# EAGLE design panandtilt (EAGLE 6.6.0)
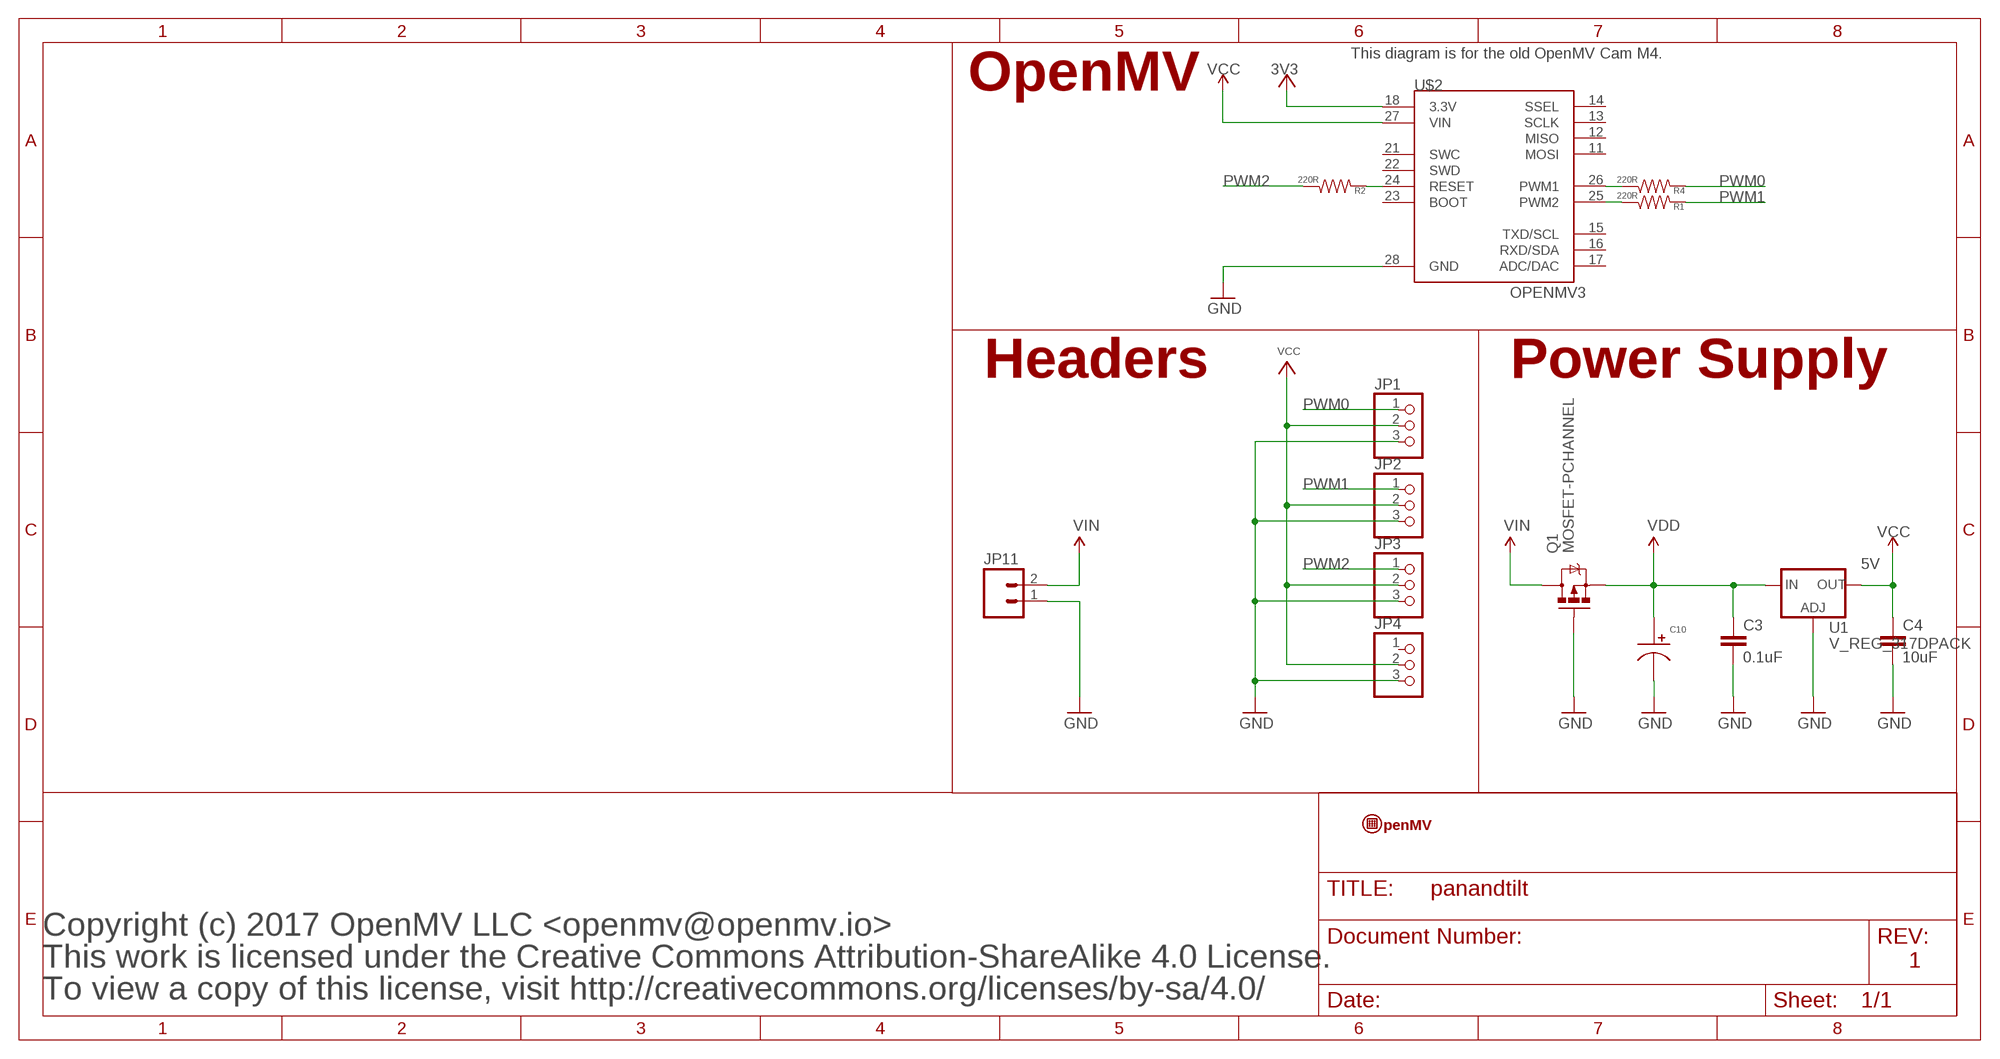
[diagram p0: schematic, sheet 1]

## Parts
C3  0.1uF  CAP0603-CAP  [0603-CAP]
C4  10uF  CAP0805  [0805]
C10  CAPACITOR_P_10MM  [CP10MM]
JP1  PINHD-1X3  [1X03]
JP2  PINHD-1X3  [1X03]
JP3  PINHD-1X3  [1X03]
JP4  PINHD-1X3  [1X03]
JP11  M023.5MM  [SCREWTERMINAL-3.5MM-2]
Q1  MOSFET-PCHANNEL  [SOT23-3]
R1  220R  RESISTOR0603-RES  [0603-RES]
R2  220R  RESISTOR0603-RES  [0603-RES]
R4  220R  RESISTOR0603-RES  [0603-RES]
U1  V_REG_317DPACK  [V-REG_DPACK]
U$2  OPENMV3  [OPENMV3]
U$9  OPENMV-LOGO  [OPENMV-LOGO]

## Nets
3V3: U$2.18(3.3V)
GND: C3.2 C4.2 C10.P$2 JP1.3 JP2.3 JP3.3 JP4.3 JP11.1 Q1.1(G) U1.1(ADJ) U$2.28(GND)
N$1: R4.1 U$2.26(PWM1)
N$2: R1.1 U$2.25(PWM2)
N$5: R2.2 U$2.24(RESET)
PWM0: JP1.1 R4.2
PWM1: JP2.1 R1.2
PWM2: JP3.1 R2.1
VCC: C4.1 JP1.2 JP2.2 JP3.2 JP4.2 U1.4(OUT) U$2.27(VIN)
VDD: C3.1 C10.P$1 Q1.2(S) U1.3(IN)
VIN: JP11.2 Q1.3(D)
Unconnected: JP4.1 U$2.11(MOSI) U$2.12(MISO) U$2.13(SCLK) U$2.14(SSEL) U$2.15(TXD/SCL) U$2.16(RXD/SDA) U$2.17(ADC/DAC) U$2.21(SWC) U$2.22(SWD) U$2.23(BOOT)

## Notes on the sheet
- This diagram is for the old OpenMV Cam M4.
- OpenMV
- Headers | Power Supply
- 5V
- Copyright (c) 2017 OpenMV LLC <openmv@openmv.io>
- This work is licensed under the Creative Commons Attribution-ShareAlike 4.0 License. | 1
- To view a copy of this license, visit http://creativecommons.org/licenses/by-sa/4.0/

## Library data of the parts
C3 C4 = sfe:CAP: Capacitor Standard 0603 ceramic capacitor, and 0.1" leaded capacitor.
C10 = MF_Passives:CAPACITOR_P: Library: MF_Passives Description: Device for Polarized Capacitors. Manufacture part number (MFG#), Voltage Rating, and Tolerance can be added via Attributes.; MGF#: N/A; TOLERANCE: N/A; VOLTAGE: N/A
JP1-JP4 = pinhead:PINHD-1X3: PIN HEADER
JP11 = SparkFun-Connectors:M02: Standard 2-pin 0.1" header. Use with - straight break away headers ( PRT-00116) - right angle break away headers (PRT-00553) - swiss pins (PRT-00743) - machine pins (PRT-00117) - female headers (PRT-00115) Molex polarized connector foot print use with: PRT-08233 with associated crimp pins and housings. 2.54_SCREWTERM for use with PRT-10571. 3.5mm Screw Terminal footprints for PRT-08084 5mm Screw Terminal footprints for use with PRT-08432; PROD_ID: CONN-08399
Q1 = SparkFun-DiscreteSemi:MOSFET-PCHANNEL: Generic PMOSFET IRLML2244 - TRANS-11153 (SOT-23 -20V -4.3A) (1.Gate 2.Source 3.Drain) FQP27P06 - COM-10349 <http://www.sparkfun.com/products/10349> (TO-220 -60V -27A) (1.Gate 2.Source 3.Drain); PROD_ID: TRANS-08285
R1 R2 R4 = sfe:RESISTOR: Resistor Basic schematic elements and footprints for 0603, 1206, and PTH resistors.
U1 = SparkFun-PowerIC:V_REG_317: Voltage Regulator Standard LM317 adjustable voltage regulator. AOI (Adjust Output Input). Google 'LM317 Calculator' for easy to use app to get the two resistor values needed. 240/720 for 5V output. 240/390 for 3.3V output. Spark Fun Electronics SKU : COM-00527; PROD_ID: IC-09888
U$2 = openmv:OPENMV3
U$9 = openmv:OPENMV-LOGO

## Net classes
1 vcc: width 1.016 mm, clearance 0.203 mm
2 antenna: width 0.363 mm, clearance 0.305 mm
3 1.8v: width 0.457 mm, clearance 0.254 mm

## Board
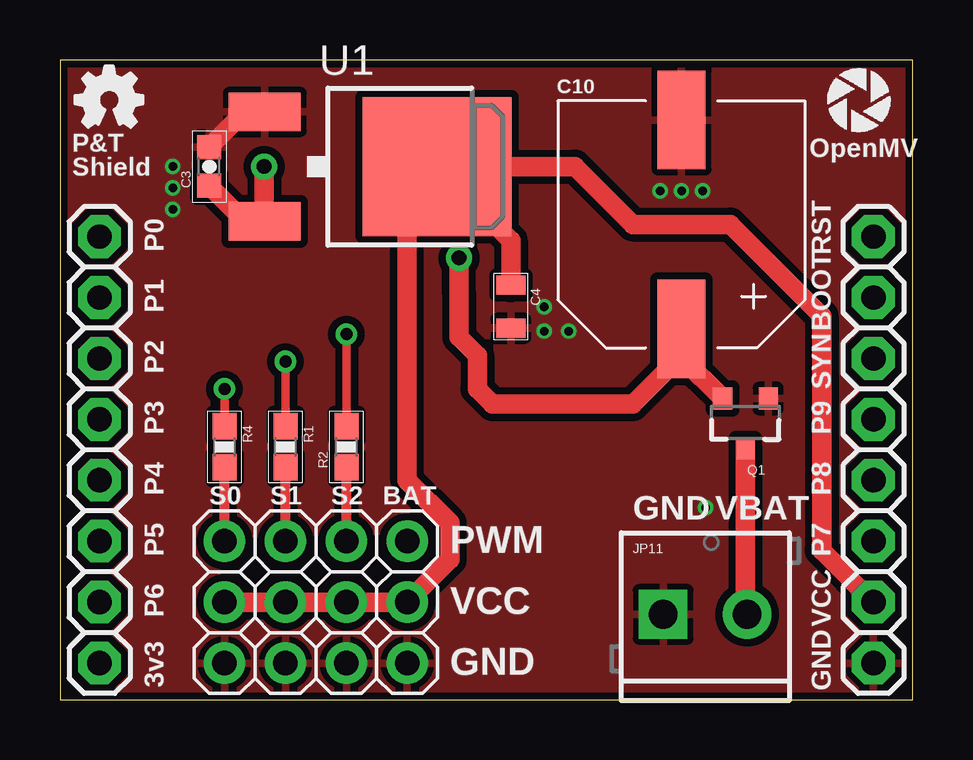
[diagram p1: board, top side]
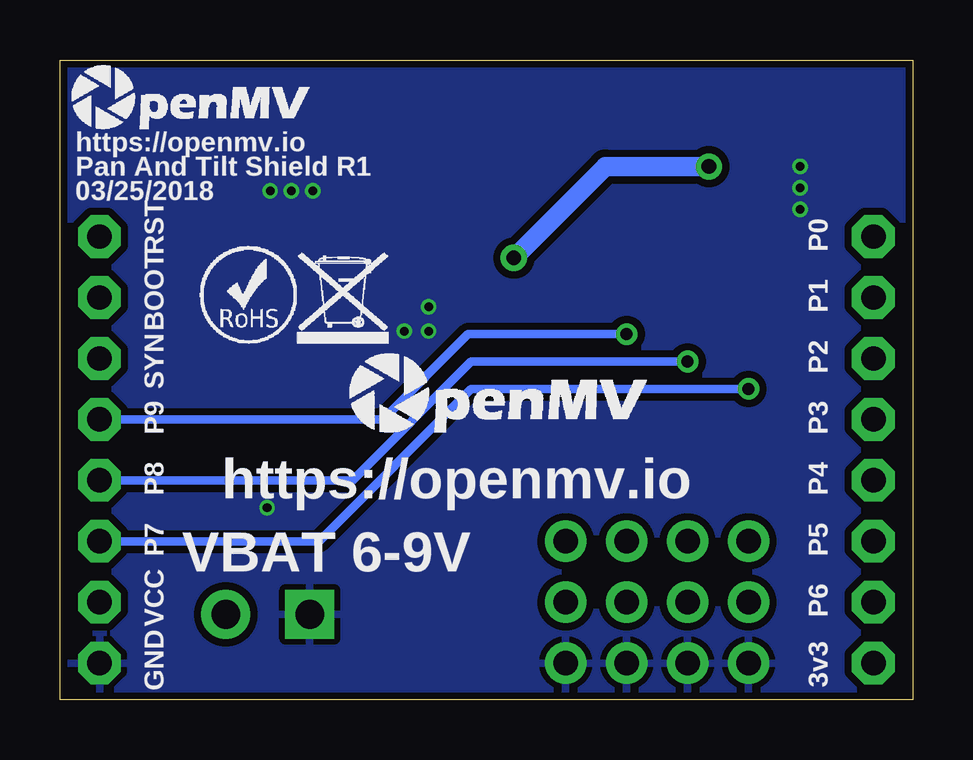
[diagram p2: board, bottom side, seen from below]

Size 35.56 x 26.67 mm. Coordinates in mm from the lower left corner, seen from the top.
Outline: 0,0 35.56,0 35.56,26.67 0,26.67 0,0
Copper layers (1*16): Top 0.035mm / dielectric 1.5mm / Bottom 0.035mm
Design rules "openmv3 *": minimum track width 5mil, minimum drill 10mil, track to track 8mil, track to pad 8mil, pad to pad 8mil, via to via 8mil, smd to smd 8mil, copper to edge 5mil, drill to drill 10mil, minimum pad ring 10mil, minimum via ring 4mil, stop-mask expansion 2mil, vias tented up to drill 30mil, thermal gap 10mil

### Footprints (pad centres in the part's own frame; a part is rotated, then mirrored left to right if it is on the bottom)
0603-CAP = smd 1 x 1: 1 -0.8,0; 2 0.8,0
0805 = smd 0.8 x 1.2: 1 -0.9,0; 2 0.9,0
CP10MM = smd 2 x 4.1: P$1 0,-4.35; P$2 0,4.35
1X03 = drill 1.016: 1 -2.54,0; 2 0,0; 3 2.54,0
SCREWTERMINAL-3.5MM-2 = drill 1.2 pad 2.032 square: 1 0,0 | drill 1.2 pad 2.032: 2 3.5,0
SOT23-3 = smd 0.8 x 0.9: 1 -0.95,-1; 2 0.95,-1; 3 0,1.1
0603-RES = smd 1.1 x 1: 1 -0.85,0; 2 0.85,0
V-REG_DPACK = smd 1.6 x 3: 1 -2.28,-4.8; 3 2.28,-4.8 | smd 5.8 x 6.2: 4 0,2.38
OPENMV3 = drill 1.016 pad 1.778 octagon: 11 1.651,19.304; 12 1.651,16.764; 13 1.651,14.224; 14 1.651,11.684; 15 1.651,9.144; 16 1.651,6.604; 17 1.651,4.064; 18 1.651,1.524; 21 33.909,19.304; 22 33.909,16.764; 23 33.909,14.224; 24 33.909,11.684; 25 33.909,9.144; 26 33.909,6.604; 27 33.909,4.064; 28 33.909,1.524

### Placement (x,y rotation side)
C3  6.22,22.23 90 top
C4  18.8,16.38 270 top
C10  25.91,19.81 0 top
JP1  6.86,4.06 270 top
JP2  9.4,4.06 270 top
JP3  11.94,4.06 270 top
JP4  14.48,4.06 270 top
JP11  25.15,3.56 0 top
Q1  28.57,11.56 180 top
R1  9.4,10.54 270 top
R2  11.94,10.54 90 top
R4  6.86,10.54 270 top
U1  13.34,22.23 270 top
U$2  0,0 0 top
U$3  [OMV-LOGO]  23.62,10.92 0 bottom
U$5  [ROHS]  29.72,14.86 0 bottom
U$6  [WEEE]  25.65,14.86 0 bottom
U$9  31.88,23.5 0 top
U$10  [OMV-LOGO-SMALL]  35.18,23.62 0 bottom
U$11  [OSHW_FILLX100_NOTEXT]  0.64,23.88 0 top

### Tracks (layer width: path | path; a pad name or v marks a point on that pad's centre or on a via)
GND  (via drill 0.36)
  Top 0.813: C3.2 7.7,24.5 U1.1
  other vias: 26.92,8 25.91,21.21 25.02,21.21 26.8,21.21 20.19,15.37 20.19,16.38 21.21,15.37 4.7,22.23 4.7,21.34 4.7,20.45
  pour Bottom (isolate 0.305): 0,0 35.56,0 35.56,26.67 0,26.67
  pour Top (isolate 0.305): 0,0 35.56,0 35.56,26.67 0,26.67
N$1  (via drill 0.5)
  Top 0.356: v6.86,12.95 R4.1
  Bottom 0.356: U$2.26 24.77,6.6 18.41,12.95 v6.86,12.95
N$2  (via drill 0.5)
  Top 0.356: v9.4,14.1 R1.1
  Bottom 0.356: U$2.25 23.37,9.14 18.41,14.1 v9.4,14.1
N$5  (via drill 0.5)
  Top 0.356: v11.94,15.24 R2.2
  Bottom 0.356: U$2.24 22.1,11.68 18.54,15.24 v11.94,15.24
PWM0
  Top 0.406: JP1.1 R4.2
PWM1
  Top 0.406: JP2.1 R1.2
PWM2
  Top 0.406: JP3.1 R2.1
VCC
  Top 0.813: U1.4 21.46,22.23 23.88,19.81 27.94,19.81 31.75,16 31.75,6.22 U$2.27 | U1.4 18.8,19.14 C4.1 | JP1.2 JP2.2 JP3.2 JP4.2 16.26,5.84 16.26,7.37 14.48,9.14 14.48,20.99 U1.4
VDD  (via drill 0.61)
  Top 0.356: 9.76,19.95 U1.3 | 16.64,16.89 16.64,16.76
  Top 0.813: 16.64,16.76 16.64,15.11 17.4,14.35 17.4,12.95 18.03,12.32 23.88,12.32 25.91,14.35 C10.P$1 25.91,14.27 Q1.2 | 16.64,16.89 v16.64,18.41 | v8.51,22.23 8.51,19.95 | 8.51,19.95 U1.3 | 8.51,19.95 7.7,19.95 C3.1
  Bottom 0.813: v16.64,18.41 12.83,22.23 v8.51,22.23
VIN
  Top 0.813: Q1.3 28.57,3.63 JP11.2

### Text on the board
tPlace: OpenMV | P&T / Shield | P0 | RST | P1 | BOOT | P2 | SYN | P3 | P9 | P4 | P8 | S0 | S1 | S2 | BAT | GND | VBAT | P5 | PWM | P7 | VCC | P6 | VCC | 3v3 | GND | GND
bPlace: https://openmv.io | Pan And Tilt Shield R1 | 03/25/2018 | P0 | RST | P1 | BOOT | P2 | SYN | P3 | P9 | P4 | P8 | https://openmv.io | P5 | P7 | VBAT 6-9V | P6 | VCC | 3v3 | GND